# Altium project PROTOTYPE.PrjPcb
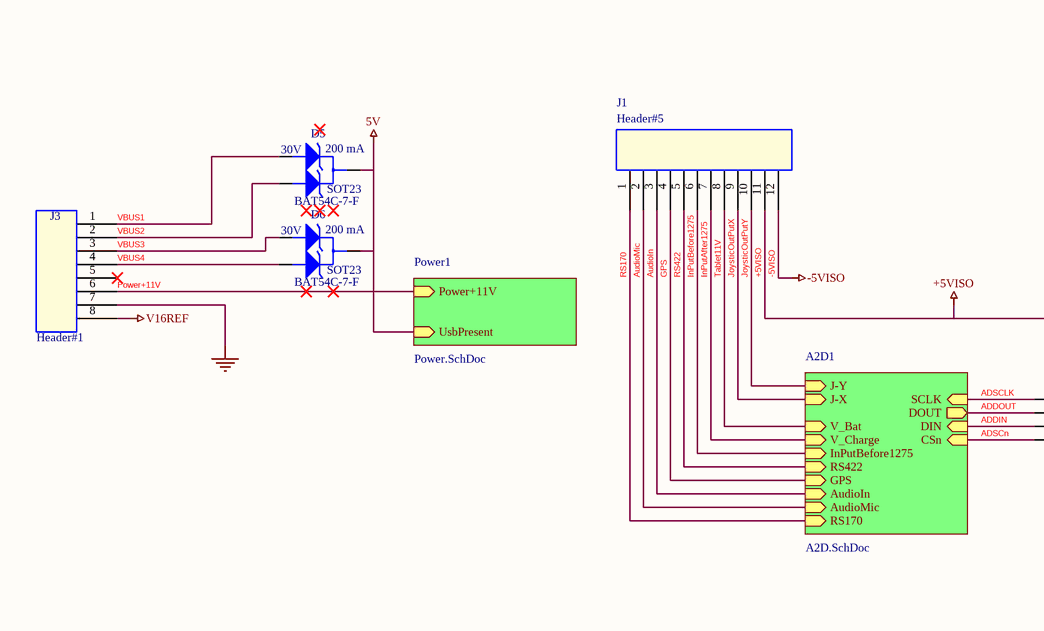
[diagram p0: Main.SchDoc, left]
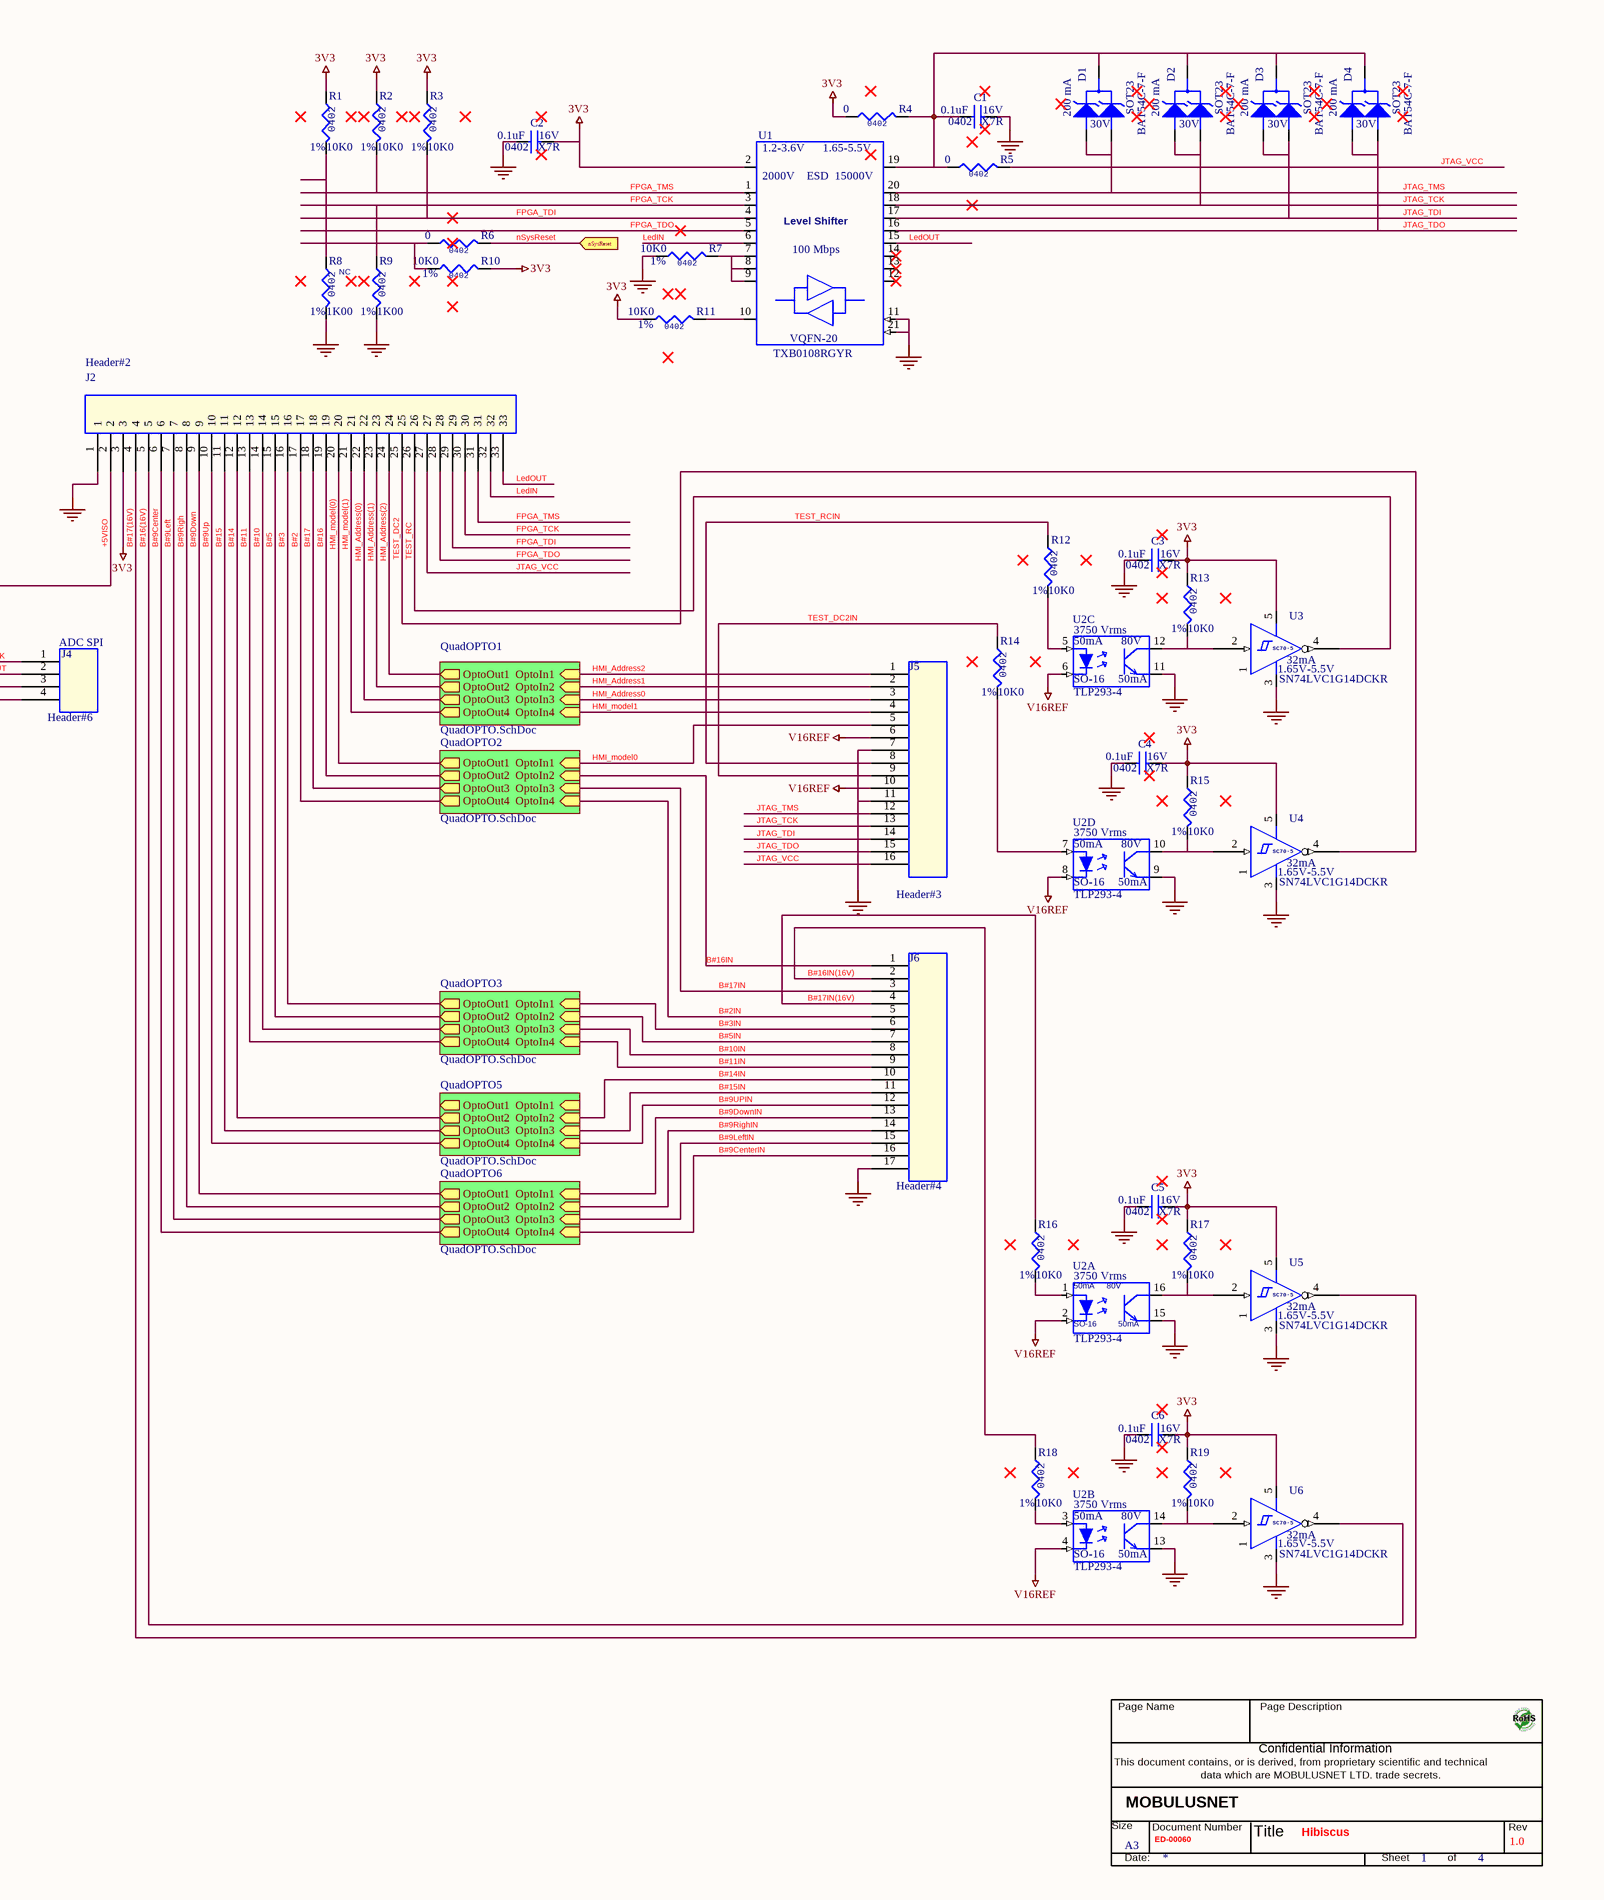
[diagram p1: Main.SchDoc, right]
4 sheets, 244 parts. Net scope: hierarchical (ports join the sheet entries above them; power ports are global).
Sheets:
  Main.SchDoc
    QuadOPTO2 = QuadOPTO.SchDoc
    QuadOPTO1 = QuadOPTO.SchDoc
    Power1 = Power.SchDoc
    QuadOPTO5 = QuadOPTO.SchDoc
    QuadOPTO6 = QuadOPTO.SchDoc
    A2D1 = A2D.SchDoc
    QuadOPTO3 = QuadOPTO.SchDoc

## Sheet Main.SchDoc
size 513 x 386 mm

### Parts
(Parts that share a designator on the sheet are numbered #1, #2 ... from top to bottom, then left to right.)
*#1  Title: Hibiscus  RevCode: 1.0  Page Size: A3  Page Number: 1  Page Count: 4  Doc: ED-00060  (hidden comment: MobulusTitleBlock)  (graphical)
C1  0.1uF  VOLTAGE: 16V  PCBFootPrint: 0402   X7R  [0402]
C2  0.1uF  VOLTAGE: 16V  PCBFootPrint: 0402   X7R  [0402]
C3  0.1uF  VOLTAGE: 16V  PCBFootPrint: 0402   X7R  [0402]
C4  0.1uF  VOLTAGE: 16V  PCBFootPrint: 0402   X7R  [0402]
C5  0.1uF  VOLTAGE: 16V  PCBFootPrint: 0402   X7R  [0402]
C6  0.1uF  VOLTAGE: 16V  PCBFootPrint: 0402   X7R  [0402]
D1  BAT54C-7-F  Current: 200 mA  VOLTAGE: 30V  FootPrint: SOT23  [SOT23_BAT54]
D2  BAT54C-7-F  Current: 200 mA  VOLTAGE: 30V  FootPrint: SOT23  [SOT23_BAT54]
D3  BAT54C-7-F  Current: 200 mA  VOLTAGE: 30V  FootPrint: SOT23  [SOT23_BAT54]
D4  BAT54C-7-F  Current: 200 mA  VOLTAGE: 30V  FootPrint: SOT23  [SOT23_BAT54]
D5  BAT54C-7-F  Current: 200 mA  VOLTAGE: 30V  FootPrint: SOT23  [SOT23_BAT54]
D6  BAT54C-7-F  Current: 200 mA  VOLTAGE: 30V  FootPrint: SOT23  [SOT23_BAT54]
J1  Header#5  [39-28-1123]
J2  Header#2  [501190-3027]
J3  Header#1  [B07B-XASK-1]
J4  Header#6  Label: ADC SPI  [B04B-XASK-1]
J5  Header#3  [501568-1507]
J6  Header#4  [501568-1507]
R1  10K0  Tolerance: 1%  [0402]
R2  10K0  Tolerance: 1%  [0402]
R3  10K0  Tolerance: 1%  [0402]
R4  0  [0402]
R5  0  [0402]
R6  0  [0402]
R7  10K0  Tolerance: 1%  [0402]
R8  1K00  Tolerance: 1%  ASSY: NC  [0402]
R9  1K00  Tolerance: 1%  [0402]
R10  10K0  Tolerance: 1%  [0402]
R11  10K0  Tolerance: 1%  [0402]
R12  10K0  Tolerance: 1%  [0402]
R13  10K0  Tolerance: 1%  [0402]
R14  10K0  Tolerance: 1%  [0402]
R15  10K0  Tolerance: 1%  [0402]
R16  10K0  Tolerance: 1%  [0402]
R17  10K0  Tolerance: 1%  [0402]
R18  10K0  Tolerance: 1%  [0402]
R19  10K0  Tolerance: 1%  [0402]
U1  TXB0108RGYR  Data rate: 100 Mbps  Voltage: 1.2-3.6V      1.65-5.5V  PcbFootprint: VQFN-20  ESD: 2000V    ESD  15000V  [VQFN-20_TXB0108]
U2  TLP293-4  Power: 50mA      80V  ISO: 3750 Vrms  FootPrint: SO-16  Current Power: 50mA  [SO-16_TLP293-4]  (parts A,B,C,D of 4)
U3  SN74LVC1G14DCKR  VOLTAGE: 1.65V-5.5V  Current: 32mA  [SC70-5_SN74LVC1G14DCKR]
U4  SN74LVC1G14DCKR  VOLTAGE: 1.65V-5.5V  Current: 32mA  [SC70-5_SN74LVC1G14DCKR]
U5  SN74LVC1G14DCKR  VOLTAGE: 1.65V-5.5V  Current: 32mA  [SC70-5_SN74LVC1G14DCKR]
U6  SN74LVC1G14DCKR  VOLTAGE: 1.65V-5.5V  Current: 32mA  [SC70-5_SN74LVC1G14DCKR]

### Sub-sheets
A2D1 = A2D.SchDoc: V_Charge (in), V_Bat (in), J-X (in), J-Y (in), DIN (in), SCLK (in), CSn (in), DOUT (out), RS170 (in), InPutBefore1275 (in), AudioIn (in), AudioMic (in), GPS (in), RS422 (in)
Power1 = Power.SchDoc: UsbPresent (in), Power+11V (in)
QuadOPTO1 = QuadOPTO.SchDoc: OptoIn4 (in), OptoOut4 (out), OptoOut3 (out), OptoIn2 (in), OptoOut2 (out), OptoIn3 (in), OptoOut1 (out), OptoIn1 (in)  | C4_PartReference: C8; C6_PartReference: C10; C5_PartReference: C9; U2_2_PartReference: U7; R8_PartReference: R23; R12_PartReference: R27; R10_PartReference: R25; U2_PartReference: U7; R__PartReference: R20; R__1_PartReference: R22; R__2_PartReference: R24; U2_3_PartReference: U7; R__3_PartReference: R26; U2_1_PartReference: U7; R6_PartReference: R21; C3_PartReference: C7; TitleBlock_Page_Number: 2; TitleBlock_Schematic_Page_Number: 1; TitleBlock_Schematic_Page_Count: 5
QuadOPTO2 = QuadOPTO.SchDoc: OptoIn4 (in), OptoOut4 (out), OptoOut3 (out), OptoIn2 (in), OptoOut2 (out), OptoIn3 (in), OptoOut1 (out), OptoIn1 (in)  | C4_PartReference: C12; C6_PartReference: C14; C5_PartReference: C13; U2_2_PartReference: U8; R8_PartReference: R31; R12_PartReference: R35; R10_PartReference: R33; U2_PartReference: U8; R__PartReference: R28; R__1_PartReference: R30; R__2_PartReference: R32; U2_3_PartReference: U8; R__3_PartReference: R34; U2_1_PartReference: U8; R6_PartReference: R29; C3_PartReference: C11; TitleBlock_Page_Number: 3; TitleBlock_Schematic_Page_Number: 2; TitleBlock_Schematic_Page_Count: 5
QuadOPTO3 = QuadOPTO.SchDoc: OptoIn4 (in), OptoOut4 (out), OptoOut3 (out), OptoIn2 (in), OptoOut2 (out), OptoIn3 (in), OptoOut1 (out), OptoIn1 (in)  | C4_PartReference: C16; C6_PartReference: C18; C5_PartReference: C17; U2_2_PartReference: U9; R8_PartReference: R39; R12_PartReference: R43; R10_PartReference: R41; U2_PartReference: U9; R__PartReference: R36; R__1_PartReference: R38; R__2_PartReference: R40; U2_3_PartReference: U9; R__3_PartReference: R42; U2_1_PartReference: U9; R6_PartReference: R37; C3_PartReference: C15; TitleBlock_Page_Number: 4; TitleBlock_Schematic_Page_Number: 3; TitleBlock_Schematic_Page_Count: 5
QuadOPTO5 = QuadOPTO.SchDoc: OptoIn4 (in), OptoOut4 (out), OptoOut3 (out), OptoIn2 (in), OptoOut2 (out), OptoIn3 (in), OptoOut1 (out), OptoIn1 (in)  | C4_PartReference: C20; C6_PartReference: C22; C5_PartReference: C21; U2_2_PartReference: U10; R8_PartReference: R47; R12_PartReference: R51; R10_PartReference: R49; U2_PartReference: U10; R__PartReference: R44; R__1_PartReference: R46; R__2_PartReference: R48; U2_3_PartReference: U10; R__3_PartReference: R50; U2_1_PartReference: U10; R6_PartReference: R45; C3_PartReference: C19; TitleBlock_Page_Number: 5; TitleBlock_Schematic_Page_Number: 4; TitleBlock_Schematic_Page_Count: 5
QuadOPTO6 = QuadOPTO.SchDoc: OptoIn4 (in), OptoOut4 (out), OptoOut3 (out), OptoIn2 (in), OptoOut2 (out), OptoIn3 (in), OptoOut1 (out), OptoIn1 (in)  | C4_PartReference: C24; C6_PartReference: C26; C5_PartReference: C25; U2_2_PartReference: U11; R8_PartReference: R55; R12_PartReference: R59; R10_PartReference: R57; U2_PartReference: U11; R__PartReference: R52; R__1_PartReference: R54; R__2_PartReference: R56; U2_3_PartReference: U11; R__3_PartReference: R58; U2_1_PartReference: U11; R6_PartReference: R53; C3_PartReference: C23; TitleBlock_Page_Number: 6; TitleBlock_Schematic_Page_Number: 5; TitleBlock_Schematic_Page_Count: 5

### Ports
nSysReset (in)

### Nets
3V3: C2.2 C3.2 C4.2 C5.2 C6.2 J2.3 R1.1 R2.1 R3.1 R4.1 R10.2 R11.1 R13.1 R15.1 R17.1 R19.1 U1.2(VCCA) U3.5(VCC) U4.5(VCC) U5.5(VCC) U6.5(VCC)
5V: D5.3(CATHODE) D6.3(CATHODE) ; sheet Power1/UsbPresent  [project net UsbPresent]
+5VISO: J1.11 J2.2
-5VISO: J1.12
GND: C1.2 C2.1 C3.1 C4.1 C5.1 C6.1 J2.1 J3.7 J5.7 J5.11 J6.17 R7.1 R8.2 R9.2 U1.11(GND) U1.21(EP) U2.9(E) U2.11(E) U2.13(E) U2.15(E) U3.3(GND) U4.3(GND) U5.3(GND) U6.3(GND)
V16REF: J3.8 J5.6 J5.10 U2.2(K) U2.4(K) U2.6(K) U2.8(K)
ADDIN: J4.3 ; sheet A2D1/DIN
ADDOUT: J4.2 ; sheet A2D1/DOUT
ADSCLK: J4.1 ; sheet A2D1/SCLK
ADSCn: J4.4 ; sheet A2D1/CSn
AudioIn: J1.3 ; sheet A2D1/AudioIn
AudioMic: J1.2 ; sheet A2D1/AudioMic
B#2: J2.17 ; sheet QuadOPTO2/OptoOut4
B#2IN: J6.5 ; sheet QuadOPTO2/OptoIn4
B#3: J2.16 ; sheet QuadOPTO3/OptoOut1
B#3IN: J6.6 ; sheet QuadOPTO3/OptoIn1
B#5: J2.15 ; sheet QuadOPTO3/OptoOut2
B#5IN: J6.7 ; sheet QuadOPTO3/OptoIn2
B#9Center: J2.6 ; sheet QuadOPTO6/OptoOut4
B#9CenterIN: J6.16 ; sheet QuadOPTO6/OptoIn4
B#9Down: J2.9 ; sheet QuadOPTO6/OptoOut1
B#9DownIN: J6.13 ; sheet QuadOPTO6/OptoIn1
B#9Left: J2.7 ; sheet QuadOPTO6/OptoOut3
B#9LeftIN: J6.15 ; sheet QuadOPTO6/OptoIn3
B#9Righ: J2.8 ; sheet QuadOPTO6/OptoOut2
B#9RighIN: J6.14 ; sheet QuadOPTO6/OptoIn2
B#9Up: J2.10 ; sheet QuadOPTO5/OptoOut4
B#9UPIN: J6.12 ; sheet QuadOPTO5/OptoIn4
B#10: J2.14 ; sheet QuadOPTO3/OptoOut3
B#10IN: J6.8 ; sheet QuadOPTO3/OptoIn3
B#11: J2.13 ; sheet QuadOPTO3/OptoOut4
B#11IN: J6.9 ; sheet QuadOPTO3/OptoIn4
B#14: J2.12 ; sheet QuadOPTO5/OptoOut2
B#14IN: J6.10 ; sheet QuadOPTO5/OptoIn2
B#15: J2.11 ; sheet QuadOPTO5/OptoOut3
B#15IN: J6.11 ; sheet QuadOPTO5/OptoIn3
B#16: J2.19 ; sheet QuadOPTO2/OptoOut2
B#16(16V): J2.5 U6.4(O)
B#16IN: J6.1 ; sheet QuadOPTO2/OptoIn2
B#16IN(16V): J6.2 R18.1
B#17: J2.18 ; sheet QuadOPTO2/OptoOut3
B#17(16V): J2.4 U5.4(O)
B#17IN: J6.3 ; sheet QuadOPTO2/OptoIn3
B#17IN(16V): J6.4 R16.1
FPGA_TCK: J2.30 R9.1 U1.3(A2)
FPGA_TDI: J2.29 R3.2 U1.4(A3)
FPGA_TDO: J2.28 U1.5(A4)
FPGA_TMS: J2.31 R2.2 U1.1(A1)
GPS: J1.4 ; sheet A2D1/GPS
HMI_Address0: J5.3 ; sheet QuadOPTO1/OptoIn3
HMI_Address1: J5.2 ; sheet QuadOPTO1/OptoIn2
HMI_Address2: J5.1 ; sheet QuadOPTO1/OptoIn1
HMI_Address(0): J2.22 ; sheet QuadOPTO1/OptoOut3
HMI_Address(1): J2.23 ; sheet QuadOPTO1/OptoOut2
HMI_Address(2): J2.24 ; sheet QuadOPTO1/OptoOut1
HMI_model0: J5.5 ; sheet QuadOPTO2/OptoIn1
HMI_model1: J5.4 ; sheet QuadOPTO1/OptoIn4
HMI_model(0): J2.20 ; sheet QuadOPTO2/OptoOut1
HMI_model(1): J2.21 ; sheet QuadOPTO1/OptoOut4
InPutAfter1275: J1.7 ; sheet A2D1/V_Charge
InPutBefore1275: J1.6 ; sheet A2D1/InPutBefore1275
JoysticOutPutX: J1.9 ; sheet A2D1/J-X  [project net J-X]
JoysticOutPutY: J1.10 ; sheet A2D1/J-Y  [project net J-Y]
JTAG_TCK: D2.1(ANODE1) D2.2(ANODE2) J5.13 U1.18(B2)
JTAG_TDI: D3.1(ANODE1) D3.2(ANODE2) J5.14 U1.17(B3)
JTAG_TDO: D4.1(ANODE1) D4.2(ANODE2) J5.15 U1.16(B4)
JTAG_TMS: D1.1(ANODE1) D1.2(ANODE2) J5.12 U1.20(B1)
JTAG_VCC: J2.27 J5.16 R5.2
LedIN: J2.32 U1.6(A5)
LedOUT: J2.33 U1.15(B5)
nSysReset: R6.2 ; port nSysReset
Power+11V: J3.6 ; sheet Power1/Power+11V
RS170: J1.1 ; sheet A2D1/RS170
RS422: J1.5 ; sheet A2D1/RS422
Tablet11V: J1.8 ; sheet A2D1/V_Bat
TEST_DC2: J2.25 U4.4(O)
TEST_DC2IN: J5.9 R14.1
TEST_RC: J2.26 U3.4(O)
TEST_RCIN: J5.8 R12.1
VBUS1: D5.1(ANODE1) J3.1
VBUS2: D5.2(ANODE2) J3.2
VBUS3: D6.1(ANODE1) J3.3
VBUS4: D6.2(ANODE2) J3.4
NetC1_1: C1.1 D1.3(CATHODE) D2.3(CATHODE) D3.3(CATHODE) D4.3(CATHODE) R4.2 R5.1 U1.19(VCCB)
NetR1_2: R1.2 R8.1
NetR6_1: R6.1 R10.1
NetR7_2: R7.2 U1.7(A6) U1.8(A7) U1.9(A8)
NetR11_2: R11.2 U1.10(OE)
NetR12_2: R12.2 U2.5(A)
NetR13_2: R13.2 U2.12(C) U3.2(I)
NetR14_2: R14.2 U2.7(A)
NetR15_2: R15.2 U2.10(C) U4.2(I)
NetR16_2: R16.2 U2.1(A)
NetR17_2: R17.2 U2.16(C) U5.2(I)
NetR18_2: R18.2 U2.3(A)
NetR19_2: R19.2 U2.14(C) U6.2(I)

Not connected (* = marked no-connect by the designer): J3 5*; U1 12(B8)* 13(B7)* 14(B6)*; U3 1(NC); U4 1(NC); U5 1(NC); U6 1(NC)

### Notes on the sheet
- (in symbol MobulusTitleBlock) Page Name; Page Description; Confidential Information; This document contains, or is derived, from proprietary scientific and technical; data which are MOBULUSNET LTD. trade secrets.; MOBULUSNET; Size; Document Number; Rev; Title; Date:; Sheet; of
- (in symbol R0402_0R_5%) 0402
- (in symbol R0402_1K00_1%) 0402
- (in symbol R0402_10K0_1%) 0402
- (in symbol SN74LVC1G14DCKR) SC70-5
- (in symbol TXB0108RGYR) Level Shifter

### Library data of the parts
C1-C6 = CAP0402_0.1uF 16V: CAP_CER_0.1uF_16V_X7R_0402; Part Number: CC0402KRX7R7BB104; NO_XNET_CONNECTION: True; TYPE: X7R; OVPN: OVCC00002; MFG: Yageo; ALT_SYMBOLS_HARD: 0402_RND; ALT_SYMBOLS: 0402_RND; PCB Footprint: 0402
D1-D6 = BAT54C-7-F: DIODE ARRAY SCHOTTKY 30V SOT23-3; OVPN: OVLS00005; MFG: Diodes Incorporated; PART NUMBER: BAT54C-7-F; PCB Footprint: SOT23_BAT54
J1 = Molex 39-28-1123 4.2mm: Lumenis Part Number: CN-2005424; Power: 600V; Pitch: 4.2mm; PCB Footprint: Header#5
J2 = Molex 501190-3027 1mm_2: Lumenis Part Number: CN-2006128; Power: 50V; Foot Print: 1.00mm; Current: 1 A; PCB Footprint: 501190-3027
J3 = JST B07B-XASK-1 2_2.5mm: 2.5mm; P/N: PO11108410; PCB Footprint: Header#1
J4 = JST B04B-XASK-1 2.5mm: P/N: PO11108404; PCB Footprint: Header#6
J5 = Molex 501568-1507 1mm R/A_2: Lumenis Part Number: CN-2002538; PCB Footprint: Header#3
J6 = Molex 501568-1507 1mm R/A_1: Lumenis Part Number: CN-2002538; PCB Footprint: Header#4
R1-R3 R7 R10-R19 = R0402_10K0_1%: RES SMD 10K OHM 1% 1/16W 0402; Part Number: RC0402FR-0710KL; NO_XNET_CONNECTION: True; OVPN: OVRS00009; MFG: Yageo; Power: 1/16W; MOUNTING: SMT
R4-R6 = R0402_0R_5%: RES SMD 0 OHM JUMPER 1/16W 0402; Part Number: RC0402JR-070RL; NO_XNET_CONNECTION: True; OVPN: OVRS00001; MFG: Yageo; Current: 1A; Power: 1/16W; MOUNTING: SMT
R8 R9 = R0402_1K00_1%: RES SMD 1K OHM 1% 1/16W 0402; Part Number: RC0402FR-071KL; NO_XNET_CONNECTION: True; OVPN: OVRS00022; MFG: Yageo; Power: 1/16W; MOUNTING: SMT
U1 = TXB0108RGYR: IC ESD SUP TVS DIODES USB OTG COMPANION DEVICE; OVPN: OVIC00147; MFG: Texas Instruments; PART NUMBER: TXB0108RGYR; PCB Footprint: VQFN-20_TXB0108
U2 = TLP293-4: OPTOISOLATOR 3.75KV TRANS SO16; PART NUMBER: TLP293-4(V4,E; OVPN: OVIC00228; MFG: Toshiba Semiconductor and Storage; PCB Footprint: SO-16_TLP293-4
U3-U6 = SN74LVC1G14DCKR: IC INVERTER SCHMITT 1CH SC70-5; OVPN: OVIC00204; MFG: Texas Instruments; PART NUMBER: SN74LVC1G14DCKR; PCB Footprint: SC70-5_SN74LVC1G14DCKR
*#1 = MobulusTitleBlock: Page Create Date: March  8, 1995; Page Modify Date: *

## Sheet QuadOPTO.SchDoc
size 513 x 386 mm
Used 5 times, as channels QuadOPTO2, QuadOPTO1, QuadOPTO5, QuadOPTO6, QuadOPTO3. Parts and nets are listed once, with the designators drawn on the sheet.
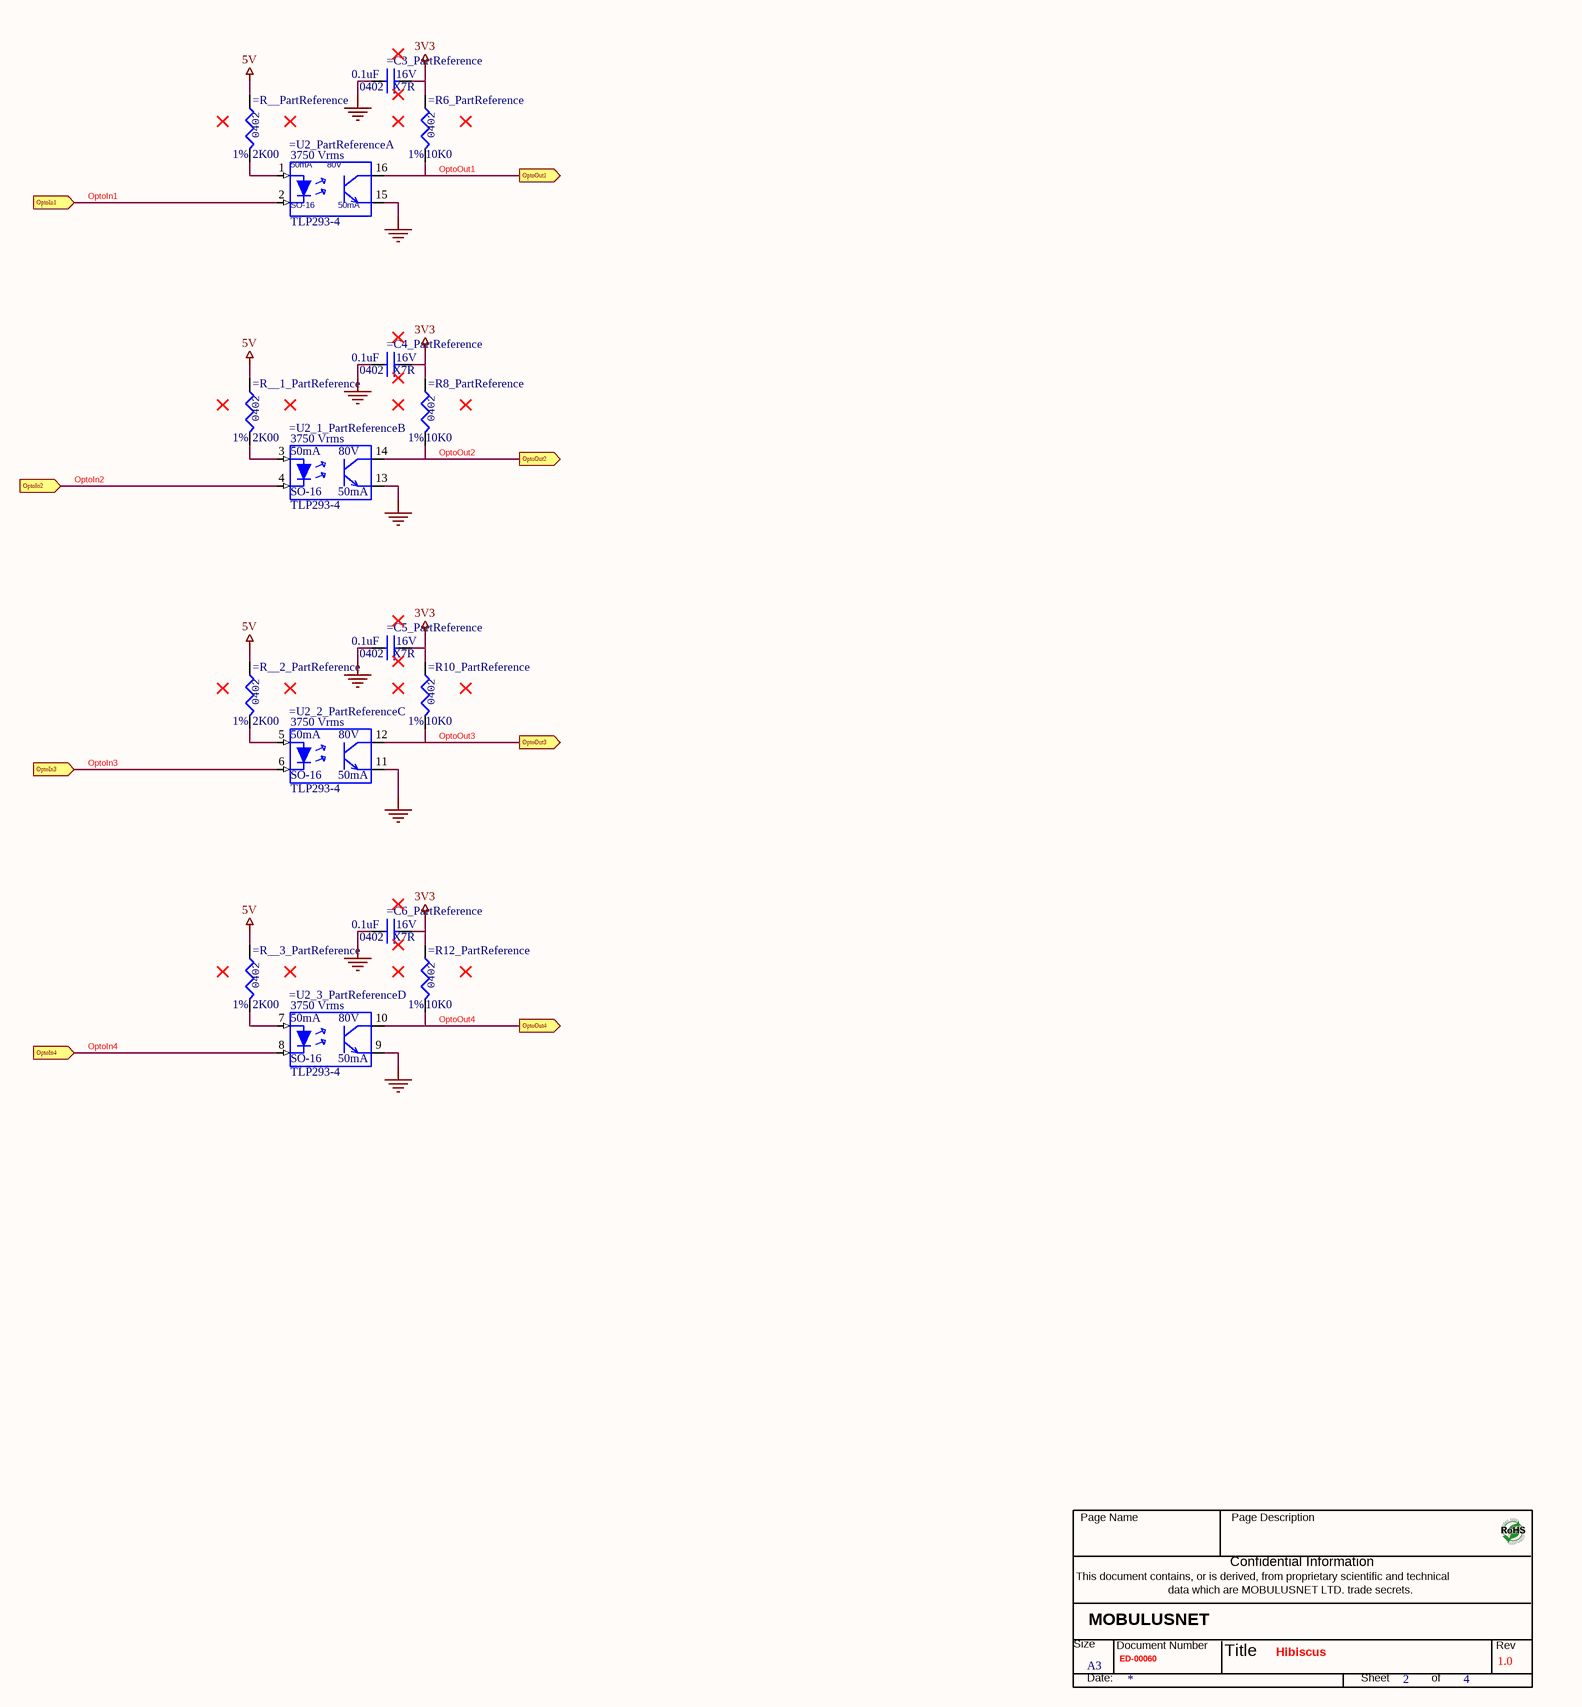
[diagram p2: QuadOPTO.SchDoc]

### Parts
*  Title: Hibiscus  RevCode: 1.0  Page Size: A3  Page Number: 2  Page Count: 4  Doc: ED-00060  (hidden comment: MobulusTitleBlock)  (graphical)
=C3_PartReference  0.1uF  VOLTAGE: 16V  PCBFootPrint: 0402   X7R  [0402]
=C4_PartReference  0.1uF  VOLTAGE: 16V  PCBFootPrint: 0402   X7R  [0402]
=C5_PartReference  0.1uF  VOLTAGE: 16V  PCBFootPrint: 0402   X7R  [0402]
=C6_PartReference  0.1uF  VOLTAGE: 16V  PCBFootPrint: 0402   X7R  [0402]
=R6_PartReference  10K0  Tolerance: 1%  [0402]
=R8_PartReference  10K0  Tolerance: 1%  [0402]
=R10_PartReference  10K0  Tolerance: 1%  [0402]
=R12_PartReference  10K0  Tolerance: 1%  [0402]
=R__1_PartReference  2K00  Tolerance: 1%  [0402]
=R__2_PartReference  2K00  Tolerance: 1%  [0402]
=R__3_PartReference  2K00  Tolerance: 1%  [0402]
=R__PartReference  2K00  Tolerance: 1%  [0402]
=U2_1_PartReference  TLP293-4  Power: 50mA      80V  ISO: 3750 Vrms  FootPrint: SO-16  Current Power: 50mA  [SO-16_TLP293-4]  (part B of 4)
=U2_2_PartReference  TLP293-4  Power: 50mA      80V  ISO: 3750 Vrms  FootPrint: SO-16  Current Power: 50mA  [SO-16_TLP293-4]  (part C of 4)
=U2_3_PartReference  TLP293-4  Power: 50mA      80V  ISO: 3750 Vrms  FootPrint: SO-16  Current Power: 50mA  [SO-16_TLP293-4]  (part D of 4)
=U2_PartReference  TLP293-4  Power: 50mA      80V  ISO: 3750 Vrms  FootPrint: SO-16  Current Power: 50mA  [SO-16_TLP293-4]  (part A of 4)

### Ports
OptoIn1 (in), OptoIn2 (in), OptoIn3 (in), OptoIn4 (in), OptoOut1 (out), OptoOut2 (out), OptoOut3 (out), OptoOut4 (out)

### Nets
3V3: =C3_PartReference.2 =C4_PartReference.2 =C5_PartReference.2 =C6_PartReference.2 =R6_PartReference.1 =R8_PartReference.1 =R10_PartReference.1 =R12_PartReference.1
5V: =R__1_PartReference.1 =R__2_PartReference.1 =R__3_PartReference.1 =R__PartReference.1
GND: =C3_PartReference.1 =C4_PartReference.1 =C5_PartReference.1 =C6_PartReference.1 =U2_1_PartReference.13(E) =U2_2_PartReference.11(E) =U2_3_PartReference.9(E) =U2_PartReference.15(E)
OptoIn1: =U2_PartReference.2(K) ; port OptoIn1
OptoIn2: =U2_1_PartReference.4(K) ; port OptoIn2
OptoIn3: =U2_2_PartReference.6(K) ; port OptoIn3
OptoIn4: =U2_3_PartReference.8(K) ; port OptoIn4
OptoOut1: =R6_PartReference.2 =U2_PartReference.16(C) ; port OptoOut1
OptoOut2: =R8_PartReference.2 =U2_1_PartReference.14(C) ; port OptoOut2
OptoOut3: =R10_PartReference.2 =U2_2_PartReference.12(C) ; port OptoOut3
OptoOut4: =R12_PartReference.2 =U2_3_PartReference.10(C) ; port OptoOut4
Net=R__1_PartReference_2: =R__1_PartReference.2 =U2_1_PartReference.3(A)
Net=R__2_PartReference_2: =R__2_PartReference.2 =U2_2_PartReference.5(A)
Net=R__3_PartReference_2: =R__3_PartReference.2 =U2_3_PartReference.7(A)
Net=R__PartReference_2: =R__PartReference.2 =U2_PartReference.1(A)

### Channels
QuadOPTO2: designators end in _QuadOPTO2; ports OptoIn1=HMI_model0 OptoIn2=B#16IN OptoIn3=B#17IN OptoIn4=B#2IN OptoOut1=HMI_model(0) OptoOut2=B#16 OptoOut3=B#17 OptoOut4=B#2
QuadOPTO1: designators end in _QuadOPTO1; ports OptoIn1=HMI_Address2 OptoIn2=HMI_Address1 OptoIn3=HMI_Address0 OptoIn4=HMI_model1 OptoOut1=HMI_Address(2) OptoOut2=HMI_Address(1) OptoOut3=HMI_Address(0) OptoOut4=HMI_model(1)
QuadOPTO5: designators end in _QuadOPTO5; ports OptoIn1=OptoIn1_QuadOPTO5 OptoIn2=B#14IN OptoIn3=B#15IN OptoIn4=B#9UPIN OptoOut1=OptoOut1_QuadOPTO5 OptoOut2=B#14 OptoOut3=B#15 OptoOut4=B#9Up
QuadOPTO6: designators end in _QuadOPTO6; ports OptoIn1=B#9DownIN OptoIn2=B#9RighIN OptoIn3=B#9LeftIN OptoIn4=B#9CenterIN OptoOut1=B#9Down OptoOut2=B#9Righ OptoOut3=B#9Left OptoOut4=B#9Center
QuadOPTO3: designators end in _QuadOPTO3; ports OptoIn1=B#3IN OptoIn2=B#5IN OptoIn3=B#10IN OptoIn4=B#11IN OptoOut1=B#3 OptoOut2=B#5 OptoOut3=B#10 OptoOut4=B#11

### Notes on the sheet
- (in symbol MobulusTitleBlock) Page Name; Page Description; Confidential Information; This document contains, or is derived, from proprietary scientific and technical; data which are MOBULUSNET LTD. trade secrets.; MOBULUSNET; Size; Document Number; Rev; Title; Date:; Sheet; of
- (in symbol R0402_2K00_1%) 0402
- (in symbol R0402_10K0_1%) 0402

### Library data of the parts
=C3_PartReference =C4_PartReference =C5_PartReference =C6_PartReference = CAP0402_0.1uF 16V: CAP_CER_0.1uF_16V_X7R_0402; Part Number: CC0402KRX7R7BB104; NO_XNET_CONNECTION: True; OVPN: OVCC00002; MFG: Yageo; ALT_SYMBOLS_HARD: 0402_RND; TYPE: X7R; ALT_SYMBOLS: 0402_RND; PCB Footprint: 0402
=R6_PartReference =R8_PartReference =R10_PartReference =R12_PartReference = R0402_10K0_1%: as R1 on sheet Main; Power: 1/16W; MOUNTING: SMT
=R__1_PartReference =R__2_PartReference =R__3_PartReference =R__PartReference = R0402_2K00_1%: RES SMD 2K OHM 1% 1/16W 0402; Part Number: RC0402FR-072KL; NO_XNET_CONNECTION: True; OVPN: OVRS00069; MFG: Yageo; Power: 1/16W; MOUNTING: SMT
=U2_1_PartReference =U2_2_PartReference =U2_3_PartReference =U2_PartReference = TLP293-4: as U2 on sheet Main; PCB Footprint: SO-16_TLP293-4
* = MobulusTitleBlock: Page Create Date: March  8, 1995; Page Modify Date: *; Page_Number: =TitleBlock_Page_Number; Schematic_Page_Number: =TitleBlock_Schematic_Page_Number; Schematic_Page_Count: =TitleBlock_Schematic_Page_Count

## Sheet Power.SchDoc
size 513 x 386 mm
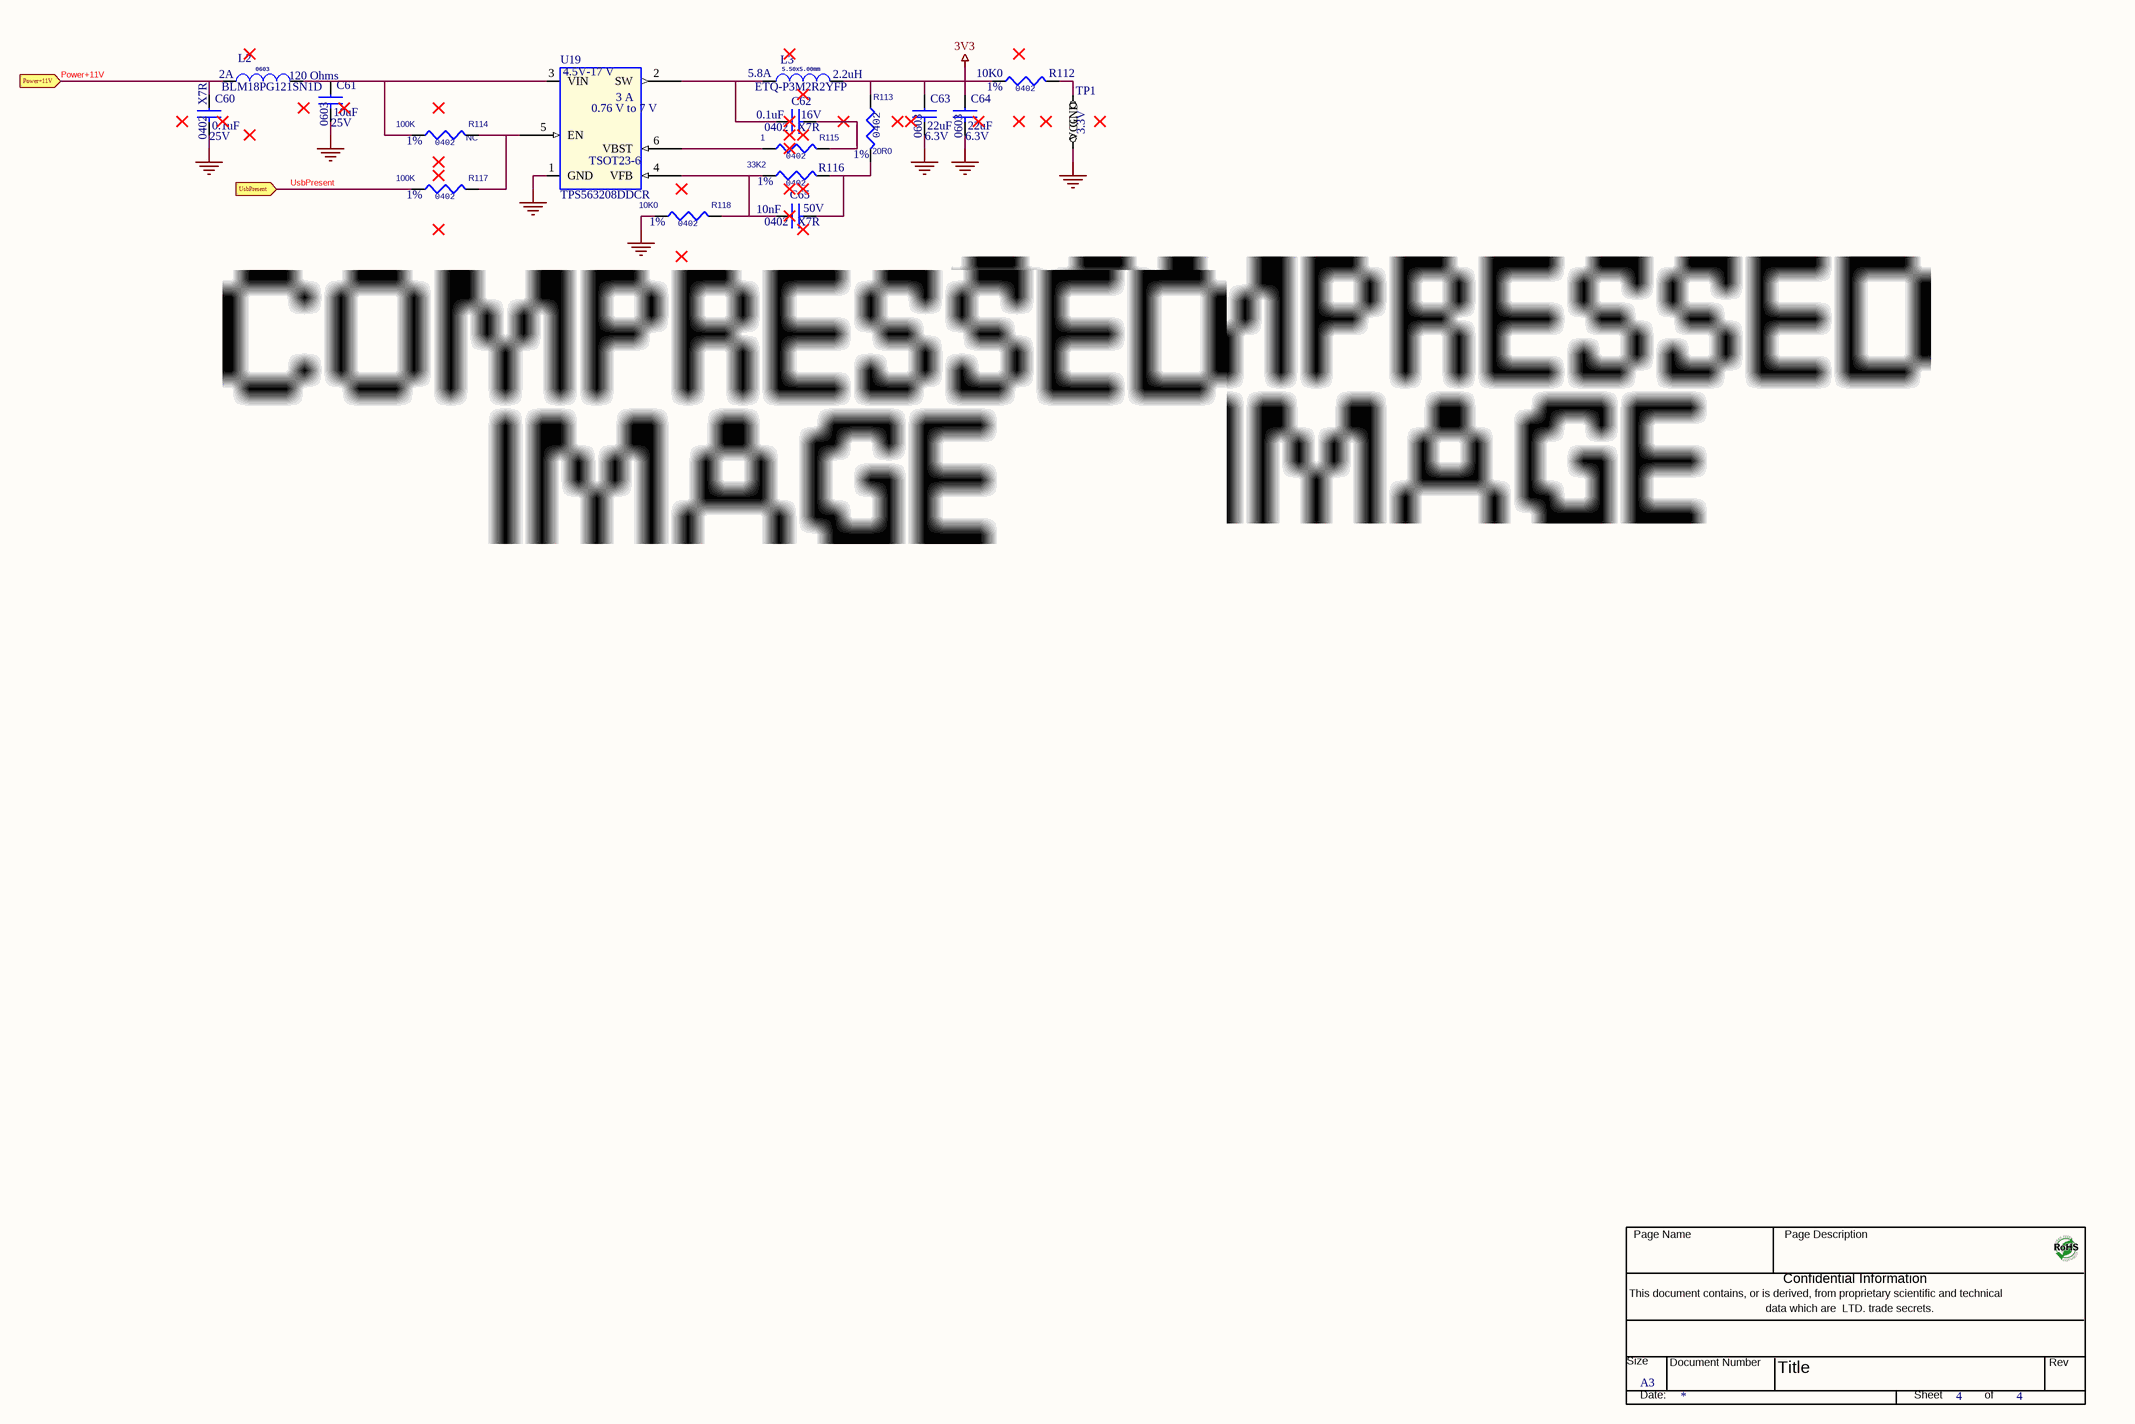
[diagram p3: Power.SchDoc]

### Parts
(Parts that share a designator on the sheet are numbered #1, #2 ... from top to bottom, then left to right.)
*#2  Page Size: A3  Page Number: 4  (hidden comment: MobulusTitleBlockBlank)  (graphical)
C60  0.1uF  TYPE: X7R  VOLTAGE: 25V  [0402]
C61  10uF  VOLTAGE: 25V  [0603]
C62  0.1uF  VOLTAGE: 16V  PCBFootPrint: 0402   X7R  [0402]
C63  22uF  VOLTAGE: 6.3V  [0603]
C64  22uF  VOLTAGE: 6.3V  [0603]
C65  10nF  PCBFootPrint: 0402   X7R  VOLTAGE: 50V  [0402]
L2  BLM18PG121SN1D  Impedance: 120 Ohms  Current: 2A  [L0603]
L3  ETQ-P3M2R2YFP  Inductance: 2.2uH  Current: 5.8A  [ETQ-P3M2R2YFP]
R112  10K0  Tolerance: 1%  [0402]
R113  20R0  Tolerance: 1%  [0402]
R114  100K  Tolerance: 1%  ASSY: NC  [0402]
R115  1  [0402]
R116  33K2  Tolerance: 1%  [0402]
R117  100K  Tolerance: 1%  [0402]
R118  10K0  Tolerance: 1%  [0402]
TP1  Label: 3.3V  [jump2_th5mm]  (hidden comment: TP Power 2 5mm)
U19  TPS563208DDCR  Current: 3 A  OUT_VOLTAGE: 0.76 V to 7 V  PcbFootprint: TSOT23-6  VOLTAGE: 4.5V-17 V  [TSOT23-6_TPS563208DDCR]

### Ports
Power+11V (in), UsbPresent (in)

### Nets
3V3: C64.1
GND: C60.2 C61.2 C63.2 C64.2 R118.1 TP1.2(GND) U19.1(GND)
UsbPresent: R117.1 ; port UsbPresent
Power+11V: C60.1 L2.1 ; port Power+11V
NetC61_1: C61.1 L2.2 R114.1 U19.3(VIN)
NetC62_1: C62.1 L3.1 U19.2(SW)
NetC62_2: C62.2 R115.2
NetC63_1: C63.1 L3.2 R112.1 R113.1
NetC65_1: C65.1 R116.1 R118.2 U19.4(VFB)
NetC65_2: C65.2 R113.2 R116.2
NetR112_2: R112.2 TP1.1(VCC)
NetR114_2: R114.2 R117.2 U19.5(EN)
NetR115_1: R115.1 U19.6(VBST)

### Notes on the sheet
- (in symbol BLM18PG121SN1D) 0603
- (in symbol ETQ-P3M2R2YFP 2.2uH 5.8A) 5.50x5.00mm
- (in symbol MobulusTitleBlockBlank) Page Name; Page Description; Confidential Information; This document contains, or is derived, from proprietary scientific and technical; data which are  LTD. trade secrets.; Size; Document Number; Rev; Title; Date:; Sheet; of
- (in symbol R0402_1R_5%) 0402
- (in symbol R0402_10K0_1%) 0402
- (in symbol R0402_20R0_1%) 0402
- (in symbol R0402_33K2_1%) 0402
- (in symbol R0402_100K_1%) 0402
- (in symbol ETQ-P3M2R2YFP) 5.50x5.00mm

### Library data of the parts
*#2 = MobulusTitleBlockBlank: Schematic Page Count: 1; Page Create Date: March  8, 1995; Page Count: 4; Page Modify Date: *; Schematic Page Number: 1
C60 = CAP0402_0.1uF 25V: CAP CER 0.1UF 25V X7R 0402; Part Number: GRM155R71E104KE14D; ALT_SYMBOLS: 0402_RND; MFG: Murata Electronics; NO_XNET_CONNECTION: True; OVPN: OVCC00093; PCBFootPrint: 0402; PCB Footprint: 0402
C61 = CAP0603_10uF 25V: CAP CER 10UF 25V X5R 0603; Part Number: CL10A106MA8NRNC; OVPN: OVCC00088; MFG: Samsung Electro-Mechanics; TYPE: X5R; PCBFootPrint: 0603; PCB Footprint: 0603
C62 = CAP0402_0.1uF 16V: as C1 on sheet Main; ALT_SYMBOLS: 0402_RND; PCB Footprint: 0402
C63 C64 = CAP0603_22uF 6.3V: CAP CER 22UF 6.3V X6S 0603; Part Number: GRM188C80J226ME15D; MFG: Murata Electronics; OVPN: OVCC00080; PCBFootPrint: 0603; TYPE: X6S; PCB Footprint: 0603
C65 = CAP0402_10nF 50V: CAP CER 10000PF 50V X7R 0402; Part Number: CL05B103KB5NNNC; ALT_SYMBOLS: 0402_RND; MFG: Samsung Electro-Mechanics; NO_XNET_CONNECTION: True; OVPN: OVCC00063; TYPE: X7R; PCB Footprint: 0402
L2 = BLM18PG121SN1D: EMI Suppression filter 2A; NO_XNET_CONNECTION: True; OVPN: OVLF00001; MFG: Murata Electronics; PART Number: BLM18PG121SN1D; PCB Footprint: L0603
L3 = ETQ-P3M2R2YFP 2.2uH 5.8A: FIXED IND 2.2UH 5.8A 24.8 MOHM; MFG: Panasonic Electronic Components; OVPN: OVLP00029; PART NUMBER: ETQ-P3M2R2YFP; PCB Footprint: ETQ-P3M2R2YFP
R112 R118 = R0402_10K0_1%: as R1 on sheet Main; Power: 1/16W; MOUNTING: SMT
R113 = R0402_20R0_1%: RES SMD 20 OHM 1% 1/16W 0402; Part Number: RC0402FR-0720RL; OVPN: OVRS00055; NO_XNET_CONNECTION: True; MFG: Yageo; Power: 1/16W; MOUNTING: SMT
R114 R117 = R0402_100K_1%: RES SMD 100K OHM 1% 1/16W 0402; Part Number: RC0402FR-07100KL; NO_XNET_CONNECTION: True; OVPN: OVRS00003; MFG: Yageo; Power: 1/16W; MOUNTING: SMT
R115 = R0402_1R_5%: RES SMD 1R0 5% 1/16W 0402; Part Number: CRGCQ0402J1R0; NO_XNET_CONNECTION: True; OVPN: OVRS00076; MFG: TE Connectivity Passive Product; Current: 1A; Power: 1/16W; MOUNTING: SMT
R116 = R0402_33K2_1%: RES 33K2 1% 1/16W 0402; Part Number: RMCF0402FT33K2; NO_XNET_CONNECTION: True; OVPN: OVRS00131; MFG: Stackpole Electronics Inc; Power: 1/16W; MOUNTING: SMT
TP1 = TP Power 2 5mm: CONN HEADER VERT 2POS 5MM; PART NUMBER: M20-9990246; OVPN: OVJS00023; MFG: Harwin Inc.; ASSY: NC; PCB Footprint: jump2_th5mm
U19 = TPS563208DDCR: IC REG BUCK ADJ 3A TSOT23-6; MFG: Texas Instruments; OVPN: OVIC00130; PART NUMBER: TPS563208DDCR; PCB Footprint: TSOT23-6_TPS563208DDCR

## Sheet A2D.SchDoc
size 513 x 386 mm
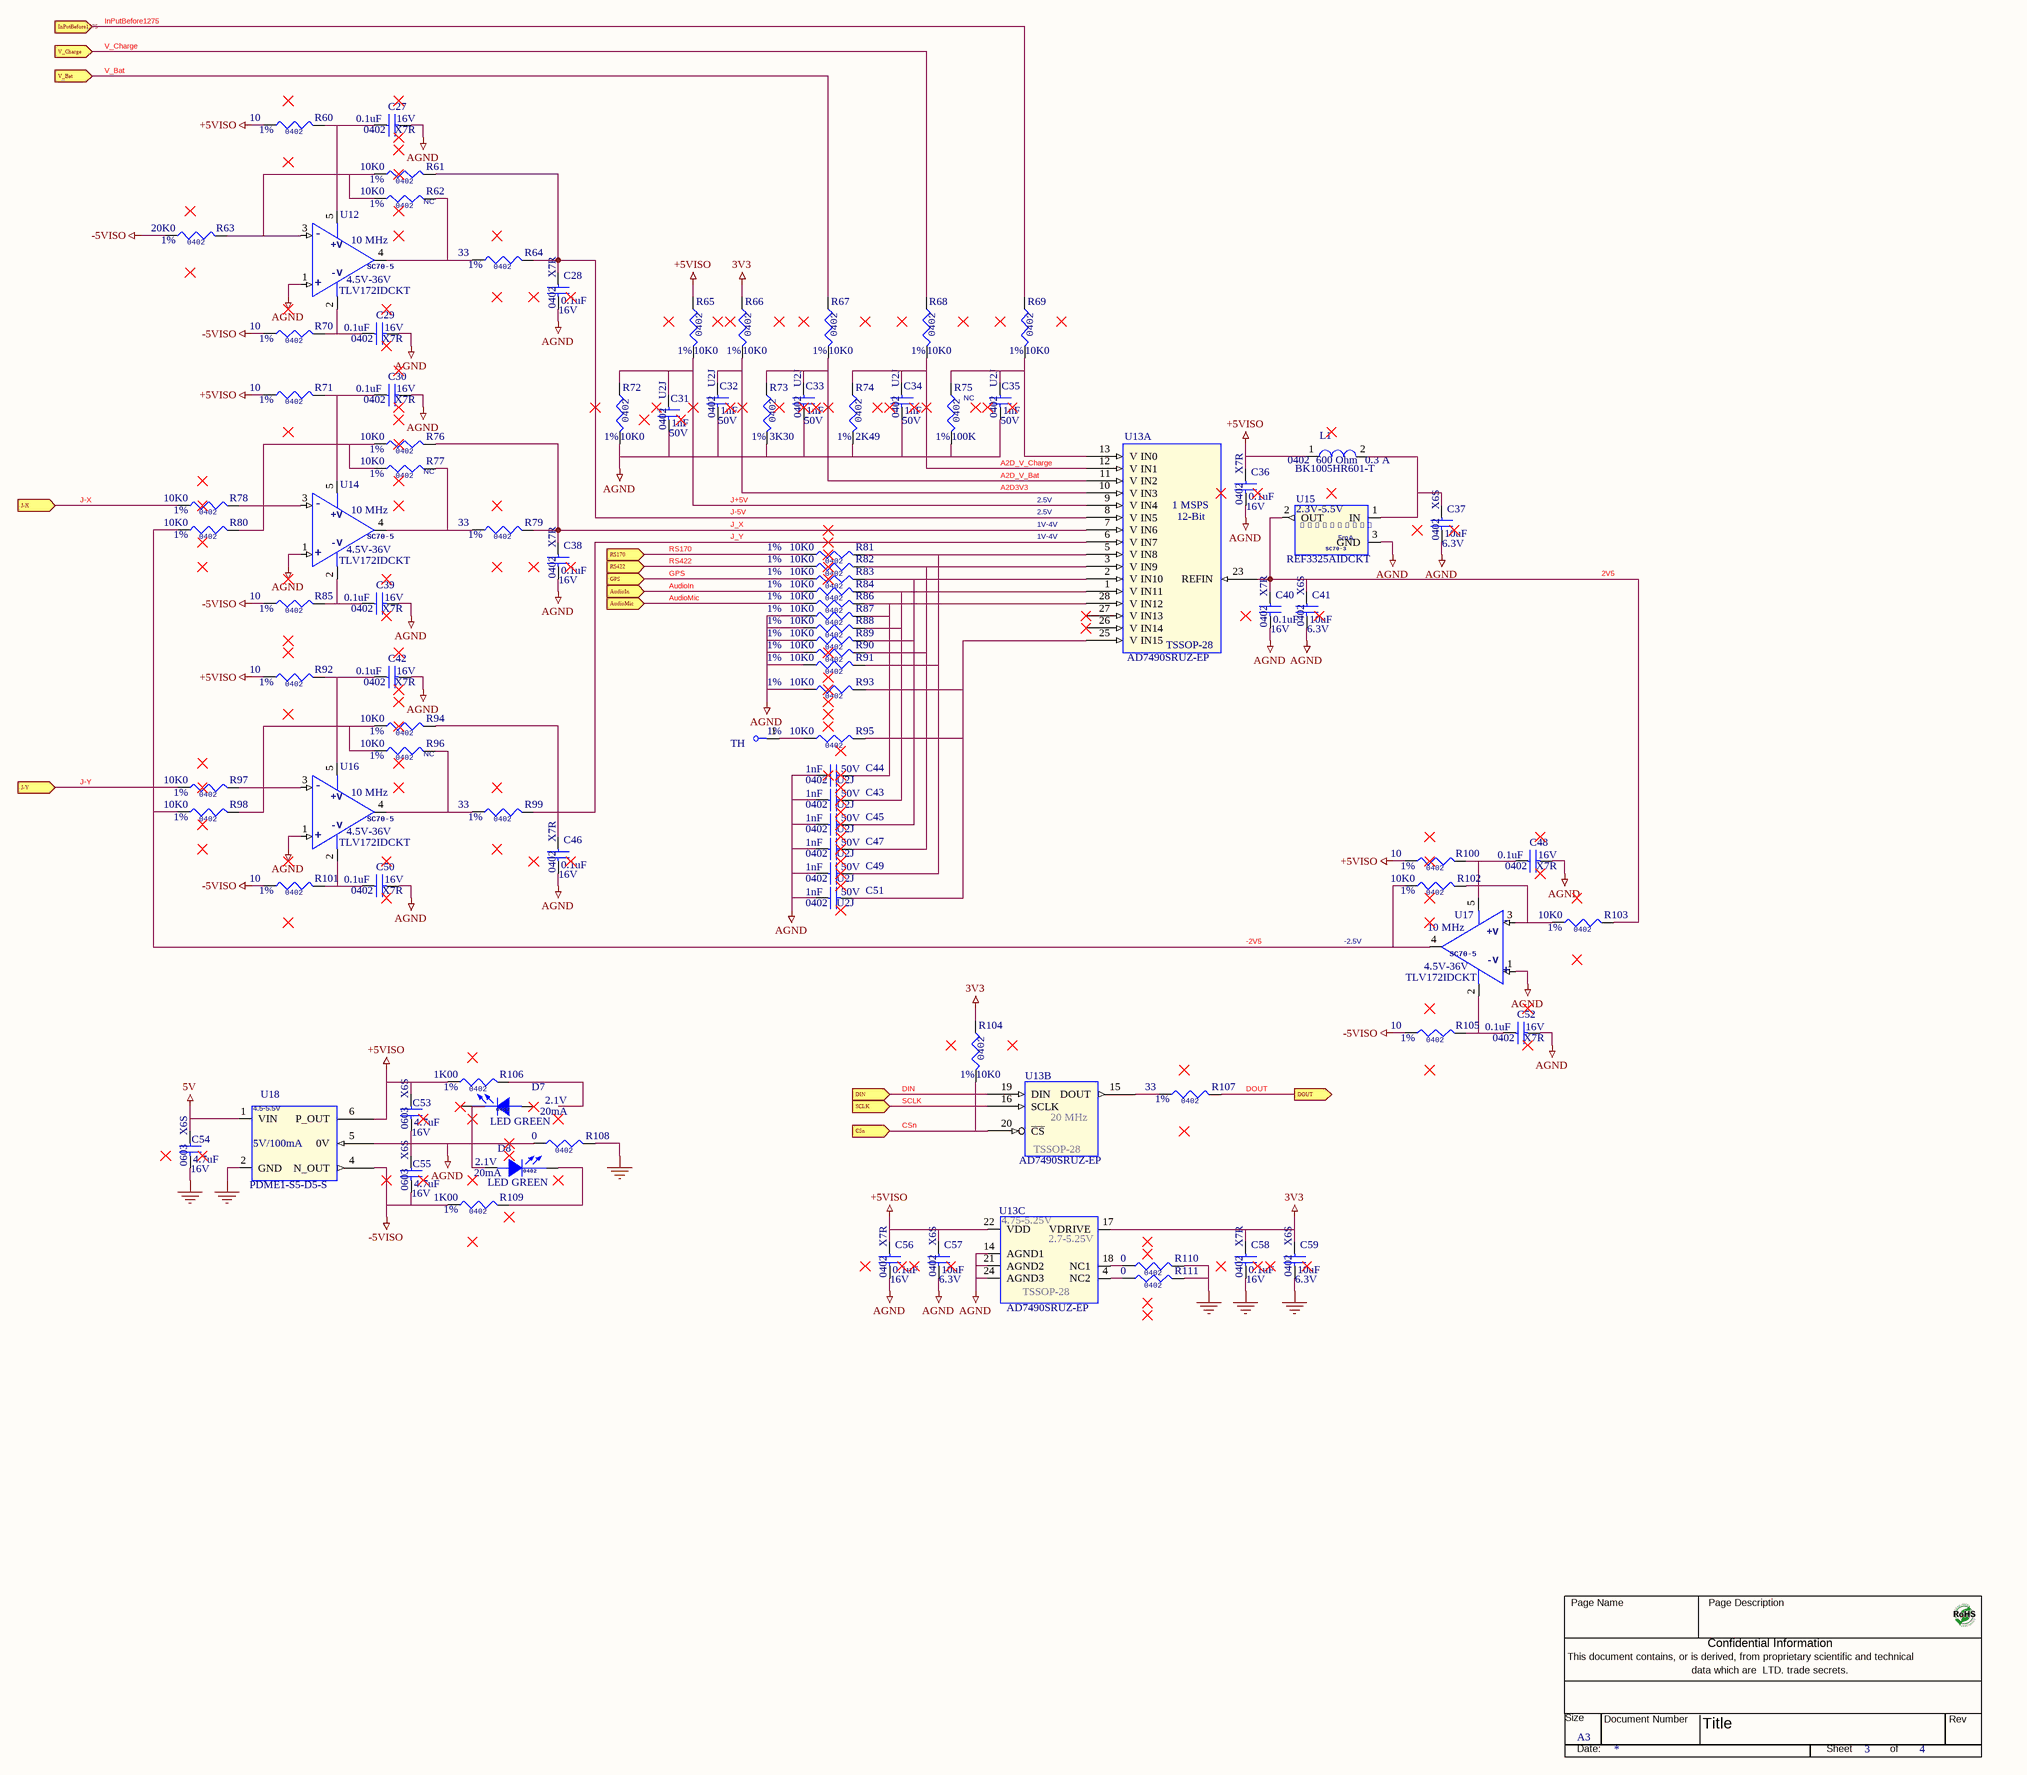
[diagram p4: A2D.SchDoc]

### Parts
(Parts that share a designator on the sheet are numbered #1, #2 ... from top to bottom, then left to right.)
*#3  Page Size: A3  Page Number: 3  Page Count: 4  (hidden comment: MobulusTitleBlockBlank)  (graphical)
C27  0.1uF  VOLTAGE: 16V  PCBFootPrint: 0402   X7R  [0402]
C28  0.1uF  VOLTAGE: 16V  PCBFootPrint: 0402   X7R  [0402]
C29  0.1uF  VOLTAGE: 16V  PCBFootPrint: 0402   X7R  [0402]
C30  0.1uF  VOLTAGE: 16V  PCBFootPrint: 0402   X7R  [0402]
C31  1nF  VOLTAGE: 50V  PCBFootPrint: 0402   U2J  [0402]
C32  1nF  VOLTAGE: 50V  PCBFootPrint: 0402   U2J  [0402]
C33  1nF  VOLTAGE: 50V  PCBFootPrint: 0402   U2J  [0402]
C34  1nF  VOLTAGE: 50V  PCBFootPrint: 0402   U2J  [0402]
C35  1nF  VOLTAGE: 50V  PCBFootPrint: 0402   U2J  [0402]
C36  0.1uF  VOLTAGE: 16V  PCBFootPrint: 0402   X7R  [0402]
C37  10uF  VOLTAGE: 6.3V  PCBFootPrint: 0402   X6S  [0402]
C38  0.1uF  VOLTAGE: 16V  PCBFootPrint: 0402   X7R  [0402]
C39  0.1uF  VOLTAGE: 16V  PCBFootPrint: 0402   X7R  [0402]
C40  0.1uF  VOLTAGE: 16V  PCBFootPrint: 0402   X7R  [0402]
C41  10uF  VOLTAGE: 6.3V  PCBFootPrint: 0402   X6S  [0402]
C42  0.1uF  VOLTAGE: 16V  PCBFootPrint: 0402   X7R  [0402]
C43  1nF  VOLTAGE: 50V  PCBFootPrint: 0402   U2J  [0402]
C44  1nF  VOLTAGE: 50V  PCBFootPrint: 0402   U2J  [0402]
C45  1nF  VOLTAGE: 50V  PCBFootPrint: 0402   U2J  [0402]
C46  0.1uF  VOLTAGE: 16V  PCBFootPrint: 0402   X7R  [0402]
C47  1nF  VOLTAGE: 50V  PCBFootPrint: 0402   U2J  [0402]
C48  0.1uF  VOLTAGE: 16V  PCBFootPrint: 0402   X7R  [0402]
C49  1nF  VOLTAGE: 50V  PCBFootPrint: 0402   U2J  [0402]
C50  0.1uF  VOLTAGE: 16V  PCBFootPrint: 0402   X7R  [0402]
C51  1nF  VOLTAGE: 50V  PCBFootPrint: 0402   U2J  [0402]
C52  0.1uF  VOLTAGE: 16V  PCBFootPrint: 0402   X7R  [0402]
C53  4.7uF  VOLTAGE: 16V  PCBFootPrint: 0603   X6S  [0603]
C54  4.7uF  VOLTAGE: 16V  PCBFootPrint: 0603   X6S  [0603]
C55  4.7uF  VOLTAGE: 16V  PCBFootPrint: 0603   X6S  [0603]
C56  0.1uF  VOLTAGE: 16V  PCBFootPrint: 0402   X7R  [0402]
C57  10uF  VOLTAGE: 6.3V  PCBFootPrint: 0402   X6S  [0402]
C58  0.1uF  VOLTAGE: 16V  PCBFootPrint: 0402   X7R  [0402]
C59  10uF  VOLTAGE: 6.3V  PCBFootPrint: 0402   X6S  [0402]
D7  LED GREEN  VOLTAGE: 2.1V  Current: 20mA  [LED_0402]
D8  LED GREEN  VOLTAGE: 2.1V  Current: 20mA  [LED_0402]
ICT1  TH  [ICT]
L1  BK1005HR601-T  Impedance: 600 Ohm  PcbFootPrint: 0402  Current: 0.3 A  [L0402]
R60  10  Tolerance: 1%  [0402]
R61  10K0  Tolerance: 1%  [0402]
R62  10K0  Tolerance: 1%  ASSY: NC  [0402]
R63  20K0  Tolerance: 1%  [0402]
R64  33  Tolerance: 1%  [0402]
R65  10K0  Tolerance: 1%  [0402]
R66  10K0  Tolerance: 1%  [0402]
R67  10K0  Tolerance: 1%  [0402]
R68  10K0  Tolerance: 1%  [0402]
R69  10K0  Tolerance: 1%  [0402]
R70  10  Tolerance: 1%  [0402]
R71  10  Tolerance: 1%  [0402]
R72  10K0  Tolerance: 1%  [0402]
R73  3K30  Tolerance: 1%  [0402]
R74  2K49  Tolerance: 1%  [0402]
R75  100K  Tolerance: 1%  ASSY: NC  [0402]
R76  10K0  Tolerance: 1%  [0402]
R77  10K0  Tolerance: 1%  ASSY: NC  [0402]
R78  10K0  Tolerance: 1%  [0402]
R79  33  Tolerance: 1%  [0402]
R80  10K0  Tolerance: 1%  [0402]
R81  10K0  Tolerance: 1%  [0402]
R82  10K0  Tolerance: 1%  [0402]
R83  10K0  Tolerance: 1%  [0402]
R84  10K0  Tolerance: 1%  [0402]
R85  10  Tolerance: 1%  [0402]
R86  10K0  Tolerance: 1%  [0402]
R87  10K0  Tolerance: 1%  [0402]
R88  10K0  Tolerance: 1%  [0402]
R89  10K0  Tolerance: 1%  [0402]
R90  10K0  Tolerance: 1%  [0402]
R91  10K0  Tolerance: 1%  [0402]
R92  10  Tolerance: 1%  [0402]
R93  10K0  Tolerance: 1%  [0402]
R94  10K0  Tolerance: 1%  [0402]
R95  10K0  Tolerance: 1%  [0402]
R96  10K0  Tolerance: 1%  ASSY: NC  [0402]
R97  10K0  Tolerance: 1%  [0402]
R98  10K0  Tolerance: 1%  [0402]
R99  33  Tolerance: 1%  [0402]
R100  10  Tolerance: 1%  [0402]
R101  10  Tolerance: 1%  [0402]
R102  10K0  Tolerance: 1%  [0402]
R103  10K0  Tolerance: 1%  [0402]
R104  10K0  Tolerance: 1%  [0402]
R105  10  Tolerance: 1%  [0402]
R106  1K00  Tolerance: 1%  [0402]
R107  33  Tolerance: 1%  [0402]
R108  0  [0402]
R109  1K00  Tolerance: 1%  [0402]
R110  0  [0402]
R111  0  [0402]
U12  TLV172IDCKT  Bandwidth: 10 MHz  VOLTAGE: 4.5V-36V  [SC70-5_TLV172IDCKT]
U13  AD7490SRUZ-EP  Throughput rates: 1 MSPS  Resolution: 12-Bit  PcbFootprint: TSSOP-28  [TSSOP-28_AD7490SRUZ]  (parts A,B,C of 3)
U14  TLV172IDCKT  Bandwidth: 10 MHz  VOLTAGE: 4.5V-36V  [SC70-5_TLV172IDCKT]
U15  REF3325AIDCKT  Current: 5mA  Definition: 2.5V�0.15%  Voltage: 2.3V-5.5V  [SC70-3_REF3320AIDCKR]
U16  TLV172IDCKT  Bandwidth: 10 MHz  VOLTAGE: 4.5V-36V  [SC70-5_TLV172IDCKT]
U17  TLV172IDCKT  Bandwidth: 10 MHz  VOLTAGE: 4.5V-36V  [SC70-5_TLV172IDCKT]
U18  PDME1-S5-D5-S  Power: 4.5-5.5V  Voltage: 5V/100mA  [PDME1-S5-D5-S]

### Ports
AudioIn (in), AudioMic (in), CSn (in), DIN (in), DOUT (out), GPS (in), InPutBefore1275 (in), J-X (in), J-Y (in), RS170 (in), RS422 (in), SCLK (in), V_Bat (in), V_Charge (in)

### Nets
3V3: C58.1 C59.1 R66.1 R104.1 U13.17(VDRIVE)
5V: C54.1 U18.1(VIN)  [project net UsbPresent]
+5VISO: C36.1 C53.1 C56.1 C57.1 L1.1 R60.1 R65.1 R71.1 R92.1 R100.1 R106.1 U13.22(VDD) U18.6(P_OUT)
-5VISO: C55.2 R63.1 R70.1 R85.1 R101.1 R105.1 R109.1 U18.4(N_OUT)
AGND: C27.2 C28.2 C29.2 C30.2 C31.2 C32.2 C33.2 C34.2 C35.2 C36.2 C37.2 C38.2 C39.2 C40.2 C41.2 C42.2 C43.1 C44.1 C45.1 C46.2 C47.1 C48.2 C49.1 C50.2 C51.1 C52.2 C56.2 C57.2 R72.2 R73.2 R74.2 R75.2 R87.1 R88.1 R89.1 R90.1 R91.1 R93.1 R108.1 U12.1(+In) U13.14(AGND1) U13.21(AGND2) U13.24(AGND3) U14.1(+In) U15.3(GND) U16.1(+In) U17.1(+In) U18.5(0V)
GND: C54.2 C58.2 C59.2 R108.2 R110.2 R111.2 U18.2(GND)
2V5: C40.1 C41.1 R103.2 U13.23(REFIN) U15.2(OUT)
-2V5: R80.1 R98.1 R102.1 U17.4(OutPut)
A2D3V3: C32.1 R66.2 U13.10(V_IN3)
A2D_V_Bat: C33.1 R67.2 R73.1 U13.11(V_IN2)
A2D_V_Charge: C34.1 R68.2 R74.1 U13.12(V_IN1)
AudioIn: R84.1 ; port AudioIn
AudioMic: R86.1 ; port AudioMic
CSn: R104.2 U13.20(~{CS}) ; port CSn  [project net ADSCn]
DIN: U13.19(DIN) ; port DIN  [project net ADDIN]
DOUT: R107.2 ; port DOUT  [project net ADDOUT]
GPS: R83.1 ; port GPS
InPutBefore1275: R69.1 ; port InPutBefore1275
J+5V: C31.1 R65.2 R72.1 U13.9(V_IN4)
J-5V: C28.1 R61.2 R64.2 U13.8(V_IN5)
J-X: R78.1 ; port J-X
J-Y: R97.1 ; port J-Y
J_X: C38.1 R76.2 R79.2 U13.7(V_IN6)
J_Y: R99.2 U13.6(V_IN7)
RS170: R81.1 ; port RS170
RS422: R82.1 ; port RS422
SCLK: U13.16(SCLK) ; port SCLK  [project net ADSCLK]
V_Bat: R67.1 ; port V_Bat  [project net Tablet11V]
V_Charge: R68.1 ; port V_Charge  [project net InPutAfter1275]
NetC27_1: C27.1 R60.2 U12.5(+V)
NetC29_1: C29.1 R70.2 U12.2(-V)
NetC30_1: C30.1 R71.2 U14.5(+V)
NetC35_1: C35.1 R69.2 R75.1 U13.13(V_IN0)
NetC37_1: C37.1 L1.2 U15.1(IN)
NetC39_1: C39.1 R85.2 U14.2(-V)
NetC42_1: C42.1 R92.2 U16.5(+V)
NetC43_2: C43.2 R84.2 R88.2 U13.1(V_IN11)
NetC44_2: C44.2 R86.2 R87.2 U13.28(V_IN12)
NetC45_2: C45.2 R83.2 R89.2 U13.2(V_IN10)
NetC46_1: C46.1 R94.2
NetC47_2: C47.2 R82.2 R90.2 U13.3(V_IN9)
NetC48_1: C48.1 R100.2 U17.5(+V)
NetC49_2: C49.2 R81.2 R91.2 U13.5(V_IN8)
NetC50_1: C50.1 R101.2 U16.2(-V)
NetC51_2: C51.2 R93.2 R95.2 U13.25(V_IN15)
NetC52_1: C52.1 R105.2 U17.2(-V)
NetC53_2: C53.2 C55.1
NetD8_1: D8.1(C) R109.2
NetICT1_1: ICT1.1 R95.1
NetR61_1: R61.1 R62.1 R63.2 U12.3(-In)
NetR62_2: R62.2 R64.1 U12.4(OutPut)
NetR76_1: R76.1 R77.1 R80.2
NetR77_2: R77.2 R79.1 U14.4(OutPut)
NetR78_2: R78.2 U14.3(-In)
NetR94_1: R94.1 R96.1 R98.2
NetR96_2: R96.2 R99.1 U16.4(OutPut)
NetR97_2: R97.2 U16.3(-In)
NetR102_2: R102.2 R103.1 U17.3(-In)
NetR107_1: R107.1 U13.15(DOUT)
NetR110_1: R110.1 U13.18(NC1)
NetR111_1: R111.1 U13.4(NC2)

Not connected (* = marked no-connect by the designer): D7 1(C)* 2(A)*; D8 2(A)*; R106 2; U13 26(V_IN14)* 27(V_IN13)*

### Notes on the sheet
- 2.5V
- 1V-4V
- -2.5V
- (in symbol LED_0402_GREEN) 0402
- (in symbol MobulusTitleBlockBlank) Page Name; Page Description; Confidential Information; This document contains, or is derived, from proprietary scientific and technical; data which are  LTD. trade secrets.; Size; Document Number; Rev; Title; Date:; Sheet; of
- (in symbol R0402_0R_5%) 0402
- (in symbol R0402_1K00_1%) 0402
- (in symbol R0402_2K49_1%) 0402
- (in symbol R0402_3K30_1%) 0402
- (in symbol R0402_10K0_1%) 0402
- (in symbol R0402_10R_1%) 0402
- (in symbol R0402_20K0_1%) 0402
- (in symbol R0402_33R_1%) 0402
- (in symbol R0402_100K_1%) 0402
- (in symbol REF3325AIDCKT) SC70-3
- (in symbol TLV172IDCKT) -; SC70-5; +

### Library data of the parts
*#3 = MobulusTitleBlockBlank: Schematic Page Count: 1; Page Create Date: March  8, 1995; Page Modify Date: *; Schematic Page Number: 1
C27-C30 C36 C38-C40 C42 C46 C48 C50 C52 C56 C58 = CAP0402_0.1uF 16V: as C1 on sheet Main; ALT_SYMBOLS: 0402_RND; PCB Footprint: 0402
C31-C35 C43-C45 C47 C49 C51 = CAP0402_1nF 50V: CAP_CER_1nF_50V_0402_U2J; Part Number: C0402C102J5JAC7867; TYPE: U2J; OVPN: OVCC00016; NO_XNET_CONNECTION: True; MFG: KEMET; ALT_SYMBOLS: 0402_RND; PCB Footprint: 0402
C37 C41 C57 C59 = CAP0402_10uF 6.3V: CAP CER 10UF 6.3V X6S 0402; Part Number: GRM155C80J106ME11J; OVPN: OVCC00087; NO_XNET_CONNECTION: True; MFG: Murata Electronics; TYPE: X6S; PCB Footprint: 0402
C53-C55 = CAP0603_4.7uF 16V: CAP_CER_4.7UF_16V_X6S_0603; Part Number: C1608X6S1C475M080AC; OVPN: OVCC00034; NO_XNET_CONNECTION: True; MFG: TDK Corporation; PCB Footprint: 0603
D7 D8 = LED_0402_GREEN: LED GREEN CLEAR CHIP SMD; PART Number: XZVG68W-2; OVPN: OVLS00001; MFG: SunLED; PCB Footprint: LED_0402
ICT1 = ICT: ASSY: N/A; PCB Footprint: ICT
L1 = BK1005HR601-T 600 0.3A: FERRITE BEAD 600 OHM 0402 1LN; OVPN: OVLF00014; NO_XNET_CONNECTION: True; MFG: Taiyo Yuden; Part Number: BK1005HR601-T; PCB Footprint: L0402
R60 R70 R71 R85 R92 R100 R101 R105 = R0402_10R_1%: RES SMD 10 OHM 1% 1/16W 0402; Part Number: RC0402FR-0710RL; NO_XNET_CONNECTION: True; OVPN: OVRS00036; MFG: Yageo; Power: 1/16W; MOUNTING: SMT
R61 R62 R65-R69 R72 R76-R78 R80-R84 R86-R91 R93-R98 R102-R104 = R0402_10K0_1%: as R1 on sheet Main; Power: 1/16W; MOUNTING: SMT
R63 = R0402_20K0_1%: RES SMD 20K OHM 1% 1/16W 0402; Part Number: RC0402FR-0720KL; OVPN: OVRS00142; NO_XNET_CONNECTION: True; MFG: Yageo; Power: 1/16W; MOUNTING: SMT
R64 R79 R99 R107 = R0402_33R_1%: RES 33R 1% 1/5W 0402; Part Number: RCS040233R0FKED; NO_XNET_CONNECTION: True; Power: 1/16W; OVPN: OVRS00013; MFG: Vishay Dale; MOUNTING: SMT
R73 = R0402_3K30_1%: RES 3K3 1% 1/16W 0402; Part Number: RT0402FRE073K3L; OVPN: OVRS00028; NO_XNET_CONNECTION: True; MFG: Yageo; Power: 1/16W; MOUNTING: SMT
R74 = R0402_2K49_1%: RES 2K49 1% 1/16W 0402; Part Number: RC0402FR-072K49L; NO_XNET_CONNECTION: True; OVPN: OVRS00004; MFG: Yageo; Power: 1/16W; MOUNTING: SMT
R75 = R0402_100K_1%: as R114 on sheet Power; Power: 1/16W; MOUNTING: SMT
R106 R109 = R0402_1K00_1%: as R8 on sheet Main; Power: 1/16W; MOUNTING: SMT
R108 R110 R111 = R0402_0R_5%: as R4 on sheet Main; Power: 1/16W; MOUNTING: SMT
U12 U14 U16 U17 = TLV172IDCKT: IC OPAMP GP 1 CIRCUIT SC70-5; MFG: Texas Instruments; OVPN: OVIC00220; PART NUMBER: TLV172IDCKT; PCB Footprint: SC70-5_TLV172IDCKT
U13 = AD7490SRUZ-EP: IC ADC 12BIT 1MSPS 16CH 28TSSOP; PART NUMBER: AD7490SRUZ-EP-RL7; fSCLK: 20 MHz; Voltage: 2.7-5.25V; VDD: 4.75-5.25V; OVPN: OVIC00219; MFG: Analog Devices Inc.; PCB Footprint: TSSOP-28_AD7490SRUZ
U15 = REF3325AIDCKT: IC VREF SERIES 0.15% SC70-3; MFG: Texas Instruments; OVPN: OVIC00251; PART NUMBER: REF3325AIDCKT; PCB Footprint: SC70-3_REF3320AIDCKR
U18 = PDME1-S5-D5-S: DC DC CONVERTER +/-5V 1W; MFG: CUI Inc.; OVPN: OVIC00225; PART NUMBER: PDME1-S5-D5-S; PCB Footprint: PDME1-S5-D5-S

## Nets that join several sheets
3V3: Main (21 pins), QuadOPTO2 (8 pins), QuadOPTO1 (8 pins), Power (C64.1), QuadOPTO5 (8 pins), QuadOPTO6 (8 pins), A2D (5 pins), QuadOPTO3 (8 pins)
+5VISO: Main (J1.11 J2.2), A2D (13 pins)
-5VISO: Main (J1.12), A2D (8 pins)
GND: Main (24 pins), QuadOPTO2 (8 pins), QuadOPTO1 (8 pins), Power (7 pins), QuadOPTO5 (8 pins), QuadOPTO6 (8 pins), A2D (7 pins), QuadOPTO3 (8 pins)
UsbPresent: Main (D5.3 D6.3), QuadOPTO2 (=R__1_PartReference_QuadOPTO2.1 =R__2_PartReference_QuadOPTO2.1 =R__3_PartReference_QuadOPTO2.1 =R__PartReference_QuadOPTO2.1), QuadOPTO1 (=R__1_PartReference_QuadOPTO1.1 =R__2_PartReference_QuadOPTO1.1 =R__3_PartReference_QuadOPTO1.1 =R__PartReference_QuadOPTO1.1), Power (R117.1), QuadOPTO5 (=R__1_PartReference_QuadOPTO5.1 =R__2_PartReference_QuadOPTO5.1 =R__3_PartReference_QuadOPTO5.1 =R__PartReference_QuadOPTO5.1), QuadOPTO6 (=R__1_PartReference_QuadOPTO6.1 =R__2_PartReference_QuadOPTO6.1 =R__3_PartReference_QuadOPTO6.1 =R__PartReference_QuadOPTO6.1), A2D (C54.1 U18.1), QuadOPTO3 (=R__1_PartReference_QuadOPTO3.1 =R__2_PartReference_QuadOPTO3.1 =R__3_PartReference_QuadOPTO3.1 =R__PartReference_QuadOPTO3.1)
ADDIN: Main (J4.3), A2D (U13.19)
ADDOUT: Main (J4.2), A2D (R107.2)
ADSCLK: Main (J4.1), A2D (U13.16)
ADSCn: Main (J4.4), A2D (R104.2 U13.20)
AudioIn: Main (J1.3), A2D (R84.1)
AudioMic: Main (J1.2), A2D (R86.1)
B#2: Main (J2.17), QuadOPTO2 (=R12_PartReference_QuadOPTO2.2 =U2_3_PartReference_QuadOPTO2.10)
B#2IN: Main (J6.5), QuadOPTO2 (=U2_3_PartReference_QuadOPTO2.8)
B#3: Main (J2.16), QuadOPTO3 (=R6_PartReference_QuadOPTO3.2 =U2_PartReference_QuadOPTO3.16)
B#3IN: Main (J6.6), QuadOPTO3 (=U2_PartReference_QuadOPTO3.2)
B#5: Main (J2.15), QuadOPTO3 (=R8_PartReference_QuadOPTO3.2 =U2_1_PartReference_QuadOPTO3.14)
B#5IN: Main (J6.7), QuadOPTO3 (=U2_1_PartReference_QuadOPTO3.4)
B#9Center: Main (J2.6), QuadOPTO6 (=R12_PartReference_QuadOPTO6.2 =U2_3_PartReference_QuadOPTO6.10)
B#9CenterIN: Main (J6.16), QuadOPTO6 (=U2_3_PartReference_QuadOPTO6.8)
B#9Down: Main (J2.9), QuadOPTO6 (=R6_PartReference_QuadOPTO6.2 =U2_PartReference_QuadOPTO6.16)
B#9DownIN: Main (J6.13), QuadOPTO6 (=U2_PartReference_QuadOPTO6.2)
B#9Left: Main (J2.7), QuadOPTO6 (=R10_PartReference_QuadOPTO6.2 =U2_2_PartReference_QuadOPTO6.12)
B#9LeftIN: Main (J6.15), QuadOPTO6 (=U2_2_PartReference_QuadOPTO6.6)
B#9Righ: Main (J2.8), QuadOPTO6 (=R8_PartReference_QuadOPTO6.2 =U2_1_PartReference_QuadOPTO6.14)
B#9RighIN: Main (J6.14), QuadOPTO6 (=U2_1_PartReference_QuadOPTO6.4)
B#9Up: Main (J2.10), QuadOPTO5 (=R12_PartReference_QuadOPTO5.2 =U2_3_PartReference_QuadOPTO5.10)
B#9UPIN: Main (J6.12), QuadOPTO5 (=U2_3_PartReference_QuadOPTO5.8)
B#10: Main (J2.14), QuadOPTO3 (=R10_PartReference_QuadOPTO3.2 =U2_2_PartReference_QuadOPTO3.12)
B#10IN: Main (J6.8), QuadOPTO3 (=U2_2_PartReference_QuadOPTO3.6)
B#11: Main (J2.13), QuadOPTO3 (=R12_PartReference_QuadOPTO3.2 =U2_3_PartReference_QuadOPTO3.10)
B#11IN: Main (J6.9), QuadOPTO3 (=U2_3_PartReference_QuadOPTO3.8)
B#14: Main (J2.12), QuadOPTO5 (=R8_PartReference_QuadOPTO5.2 =U2_1_PartReference_QuadOPTO5.14)
B#14IN: Main (J6.10), QuadOPTO5 (=U2_1_PartReference_QuadOPTO5.4)
B#15: Main (J2.11), QuadOPTO5 (=R10_PartReference_QuadOPTO5.2 =U2_2_PartReference_QuadOPTO5.12)
B#15IN: Main (J6.11), QuadOPTO5 (=U2_2_PartReference_QuadOPTO5.6)
B#16: Main (J2.19), QuadOPTO2 (=R8_PartReference_QuadOPTO2.2 =U2_1_PartReference_QuadOPTO2.14)
B#16IN: Main (J6.1), QuadOPTO2 (=U2_1_PartReference_QuadOPTO2.4)
B#17: Main (J2.18), QuadOPTO2 (=R10_PartReference_QuadOPTO2.2 =U2_2_PartReference_QuadOPTO2.12)
B#17IN: Main (J6.3), QuadOPTO2 (=U2_2_PartReference_QuadOPTO2.6)
GPS: Main (J1.4), A2D (R83.1)
HMI_Address0: Main (J5.3), QuadOPTO1 (=U2_2_PartReference_QuadOPTO1.6)
HMI_Address1: Main (J5.2), QuadOPTO1 (=U2_1_PartReference_QuadOPTO1.4)
HMI_Address2: Main (J5.1), QuadOPTO1 (=U2_PartReference_QuadOPTO1.2)
HMI_Address(0): Main (J2.22), QuadOPTO1 (=R10_PartReference_QuadOPTO1.2 =U2_2_PartReference_QuadOPTO1.12)
HMI_Address(1): Main (J2.23), QuadOPTO1 (=R8_PartReference_QuadOPTO1.2 =U2_1_PartReference_QuadOPTO1.14)
HMI_Address(2): Main (J2.24), QuadOPTO1 (=R6_PartReference_QuadOPTO1.2 =U2_PartReference_QuadOPTO1.16)
HMI_model0: Main (J5.5), QuadOPTO2 (=U2_PartReference_QuadOPTO2.2)
HMI_model1: Main (J5.4), QuadOPTO1 (=U2_3_PartReference_QuadOPTO1.8)
HMI_model(0): Main (J2.20), QuadOPTO2 (=R6_PartReference_QuadOPTO2.2 =U2_PartReference_QuadOPTO2.16)
HMI_model(1): Main (J2.21), QuadOPTO1 (=R12_PartReference_QuadOPTO1.2 =U2_3_PartReference_QuadOPTO1.10)
InPutAfter1275: Main (J1.7), A2D (R68.1)
InPutBefore1275: Main (J1.6), A2D (R69.1)
J-X: Main (J1.9), A2D (R78.1)
J-Y: Main (J1.10), A2D (R97.1)
Power+11V: Main (J3.6), Power (C60.1 L2.1)
RS170: Main (J1.1), A2D (R81.1)
RS422: Main (J1.5), A2D (R82.1)
Tablet11V: Main (J1.8), A2D (R67.1)